# Altium schematic sheet 探测器最终图-论文用.SchDoc: 智能消防联动系统
size A3; Time: 2017.05.04; ProjectName: 探测器
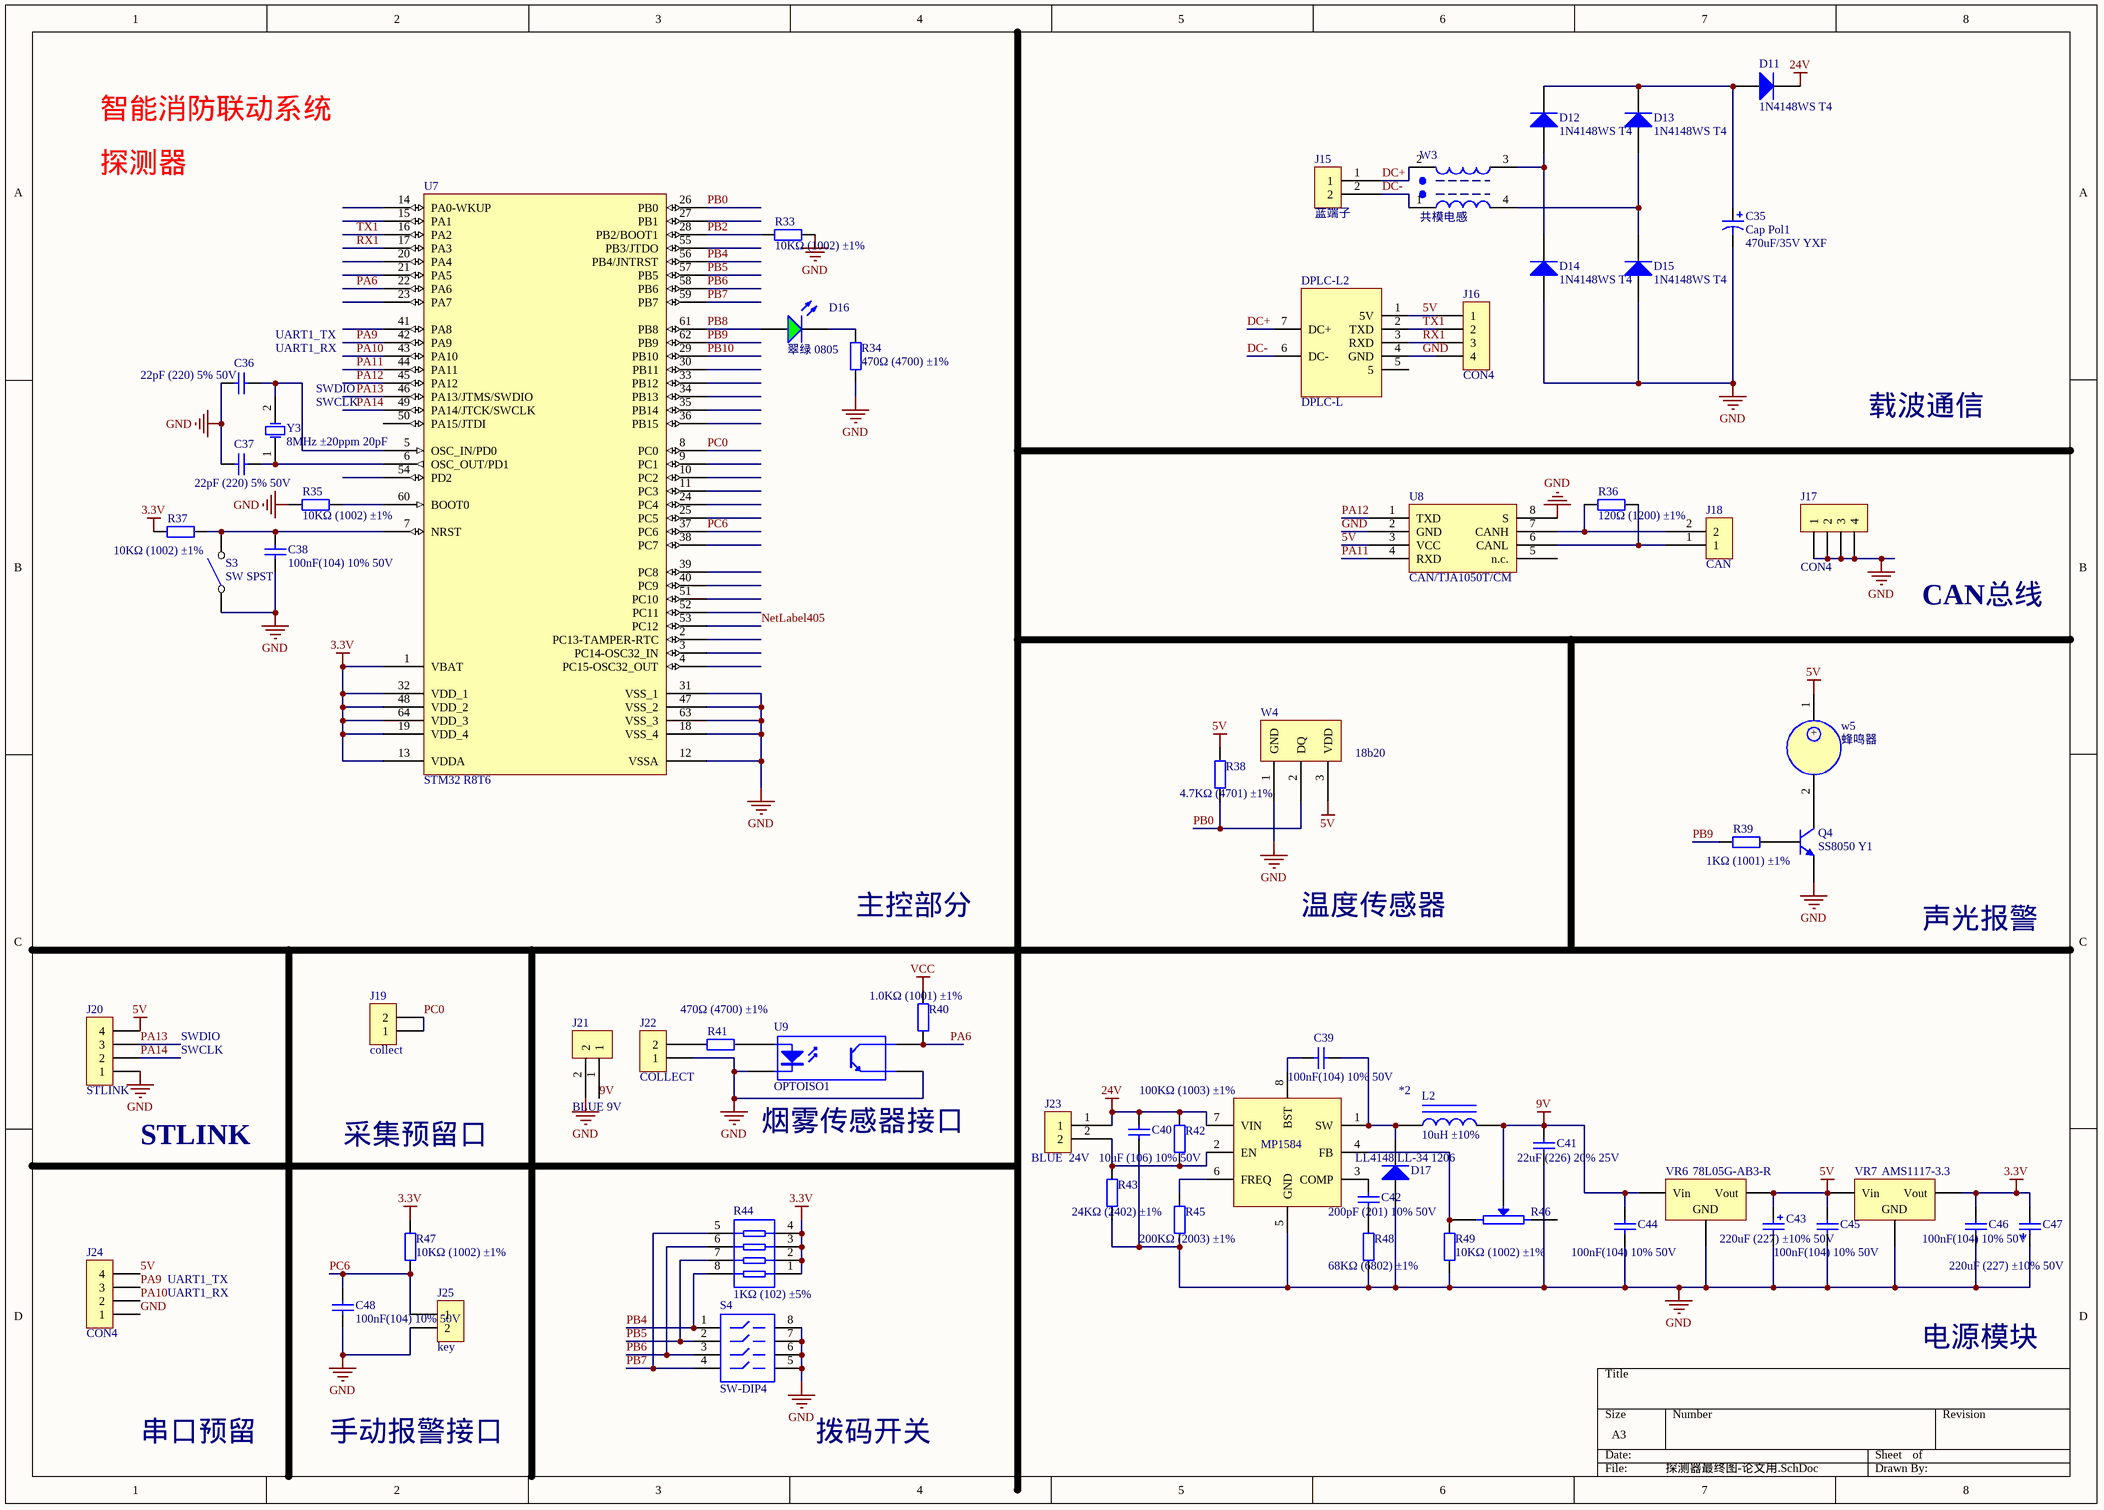
[diagram p0: 探测器最终图-论文用.SchDoc]

## Parts
*2  MP1584
C35  Cap Pol1  value 470uF/35V YXF  [RB.2/.4]
C36  22pF (220) 5% 50V  [LC-0805_C]
C37  22pF (220) 5% 50V  [LC-0805_C]
C38  100nF(104) 10% 50V  [LC-0805_C]
C39  100nF(104) 10% 50V  [LC-0805_C]
C40  10uF (106) 10% 50V  [LC-1206_C]
C41  22uF (226) 20% 25V  [LC-0805_C]
C42  200pF (201) 10% 50V  [LC-0805_C]
C43  220uF (227) ±10% 50V  [LC-CASE-B_3528]
C44  100nF(104) 10% 50V  [LC-0805_C]
C45  100nF(104) 10% 50V  [LC-0805_C]
C46  100nF(104) 10% 50V  [LC-0805_C]
C47  220uF (227) ±10% 50V  [LC-CASE-B_3528]
C48  100nF(104) 10% 50V  [LC-0805_C]
D11  1N4148WS T4  [LC-SOD-323]
D12  1N4148WS T4  [LC-SOD-323]
D13  1N4148WS T4  [LC-SOD-323]
D14  1N4148WS T4  [LC-SOD-323]
D15  1N4148WS T4  [LC-SOD-323]
D16  翠绿 0805  [LC-0805_LED_S1]
D17  LL4148 LL-34 1206  [LC-LL-34]
DPLC-L2  DPLC-L  [DPLC-L]
J15  蓝端子  [蓝端子]
J16  CON4  [SIP4]
J17  CON4  [SIP4]
J18  CAN  [蓝端子]
J19  collect  [SIP2]
J20  STLINK  [SIP4]
J21  BLUE 9V  [蓝端子]
J22  COLLECT  [SIP2]
J23  BLUE  24V  [蓝端子]
J24  CON4  [SIP4]
J25  key  [SIP2]
L2  10uH ±10%  [LC-0805_L]
Q4  SS8050 Y1  [LC-SOT-23(SOT-23-3)]
R33  10KΩ (1002) ±1%  [LC-0805_R]
R34  470Ω (4700) ±1%  [LC-0805_R]
R35  10KΩ (1002) ±1%  [LC-0805_R]
R36  120Ω (1200) ±1%  [LC-0805_R]
R37  10KΩ (1002) ±1%  [LC-0805_R]
R38  4.7KΩ (4701) ±1%  [LC-0805_R]
R39  1KΩ (1001) ±1%  [LC-0805_R]
R40  1.0KΩ (1001) ±1%  [LC-0805_R]
R41  470Ω (4700) ±1%  [LC-0805_R]
R42  100KΩ (1003) ±1%  [LC-0805_R]
R43  24KΩ (2402) ±1%  [LC-0805_R]
R44  1KΩ (102) ±5%  [LC-0603_Rx4]
R45  200KΩ (2003) ±1%  [LC-0805_R]
R46  2  (value not drawn)
R47  10KΩ (1002) ±1%  [LC-0805_R]
R48  68KΩ (6802) ±1%  [LC-0805_R]
R49  10KΩ (1002) ±1%  [LC-0805_R]
S3  SW SPST  [单片机小按键]
S4  SW-DIP4  [4位拨码开关]
U7  STM32 R8T6  [LC-LQFP-64_10x10x05P]
U8  CAN/TJA1050T/CM  [LC-SOIC-8_150mil]
U9  OPTOISO1  [LC-SOP-4_P2.54]
VR6  78L05G-AB3-R  [LC-SOT-89(SOT-89-3)]
VR7  AMS1117-3.3  [LC-SOT-223]
W3  共模电感  [共模电感]
W4  18b20  [DS18B20]
w5  蜂鸣器  [蜂鸣器]
Y3  8MHz ±20ppm 20pF  [LC-SMD-5032_2P]

## Nets
3.3V: C46.1 C47.2 R37.1 R44.1 R44.2 R44.3 R44.4 R47.2 U7.1(VBAT) U7.13(VDDA) U7.19(VDD_4) U7.32(VDD_1) U7.48(VDD_2) U7.64(VDD_3) VR7.2(Vout)
5V: C43.1 C45.2 DPLC-L2.1(5V) J16.1 J20.4 J24.4 R38.2 U8.3(VCC) VR6.3(Vout) VR7.3(Vin) W4.3(VDD) w5.1(+)
9V: C41.2 C44.2 J21.1 L2.2 R46.3(W) VR6.1(Vin)
24V: *2.7(VIN) C40.2 D11.2(K) J23.1 R42.2
GND: *2.5(GND) C35.2 C36.1 C37.1 C38.1 C40.1 C41.1 C43.2 C44.1 C45.1 C46.2 C47.1 C48.1 D14.1(A) D15.1(A) D17.1(A) DPLC-L2.4(GND) J16.4 J17.1 J17.2 J17.3 J17.4 J20.1 J21.2 J22.1 J24.1 J25.2 Q4.2(E) R33.1 R34.1 R35.1 R43.1 R45.1 R48.1 R49.1 S3.1(COMMON) S4.5 S4.6 S4.7 S4.8 U7.12(VSSA) U7.18(VSS_4) U7.31(VSS_1) U7.47(VSS_2) U7.63(VSS_3) U8.2(GND) U8.8(S) U9.2(K) U9.3(E) VR6.2(GND) VR7.1(GND) W4.1(GND)
VCC: R40.2
DC+: DPLC-L2.7(DC+) J15.1 W3.2
DC-: DPLC-L2.6(DC-) J15.2 W3.1
NetLabel405: U7.53(PC12)
PA6: R40.1 U7.22(PA6) U9.4(C)
PA9: J24.3 U7.42(PA9)
PA10: J24.2 U7.43(PA10)
PA11: U7.44(PA11) U8.4(RXD)
PA12: U7.45(PA12) U8.1(TXD)
PA13: J20.3 U7.46(PA13/JTMS/SWDIO)
PA14: J20.2 U7.49(PA14/JTCK/SWCLK)
PB0: R38.1 U7.26(PB0) W4.2(DQ)
PB2: R33.2 U7.28(PB2/BOOT1)
PB4: R44.8 S4.1 U7.56(PB4/JNTRST)
PB5: R44.7 S4.2 U7.57(PB5)
PB6: R44.6 S4.3 U7.58(PB6)
PB7: R44.5 S4.4 U7.59(PB7)
PB8: D16.A U7.61(PB8)
PB9: R39.1 U7.62(PB9)
PB10: U7.29(PB10)
PC0: J19.1 J19.2 U7.8(PC0)
PC6: C48.2 J25.1 R47.1 U7.37(PC6)
RX1: DPLC-L2.3(RXD) J16.3 U7.17(PA3)
TX1: DPLC-L2.2(TXD) J16.2 U7.16(PA2)
Net*2_1: *2.1(SW) C39.2 D17.2(K) L2.1
Net*2_2: *2.2(EN) J23.2 R42.1 R43.2
Net*2_3: *2.3(COMP) C42.2
Net*2_4: *2.4(FB) R46.1 R49.2
Net*2_6: *2.6(FREQ) R45.2
Net*2_8: *2.8(BST) C39.1
NetC35_1: C35.1 D11.1(A) D12.2(K) D13.2(K)
NetC36_2: C36.2 U7.5(OSC_IN/PD0) Y3.2(OSC2)
NetC37_2: C37.2 U7.6(OSC_OUT/PD1) Y3.1(OSC1)
NetC38_2: C38.2 R37.2 S3.2(NO) U7.7(NRST)
NetC42_1: C42.1 R48.2
NetD12_1: D12.1(A) D14.2(K) W3.3
NetD13_1: D13.1(A) D15.2(K) W3.4
NetD16_K: D16.K R34.2
NetJ18_1: J18.1 R36.2 U8.6(CANL)
NetJ18_2: J18.2 R36.1 U8.7(CANH)
NetJ22_2: J22.2 R41.2
NetQ4_1: Q4.1(B) R39.2
NetQ4_3: Q4.3(C) w5.2
NetR35_2: R35.2 U7.60(BOOT0)
NetR41_1: R41.1 U9.1(A)

Not connected (* = marked no-connect by the designer): DPLC-L2 5; R46 2; U7 2(PC13-TAMPER-RTC) 3(PC14-OSC32_IN) 4(PC15-OSC32_OUT) 9(PC1) 10(PC2) 11(PC3) 14(PA0-WKUP) 15(PA1) 20(PA4) 21(PA5) 23(PA7) 24(PC4) 25(PC5) 27(PB1) 30(PB11) 33(PB12) 34(PB13) 35(PB14) 36(PB15) 38(PC7) 39(PC8) 40(PC9) 41(PA8) 50(PA15/JTDI) 51(PC10) 52(PC11) 54(PD2) 55(PB3/JTDO); U8 5(n.c.)

## Notes on the sheet
- 智能消防联动系统
- 探测器
- (near C36) UART1_TX
- (near C36) UART1_RX
- SWDIO
- (near Y3) SWCLK
- 载波通信
- CAN总线
- 主控部分
- 温度传感器
- 声光报警
- SWCLK
- STLINK
- 采集预留口
- (near U9) 烟雾传感器接口
- UART1_TX
- UART1_RX
- 电源模块
- 串口预留
- 手动报警接口
- 拨码开关

## Library data of the parts
C35 = Cap Pol1: Polarized Capacitor (Radial); Published: 8-Jun-2000; LatestRevisionDate: 17-Jul-2002; LatestRevisionNote: Re-released for DXP Platform.; PackageReference: RB7.6-15; Publisher: Altium Limited; PackageDescription: Polarized Capacitor (Radial); 2 Leads
C36 C37 = 0805 22pF (220) 5% 50V: 贴片电容; ComponentLink1Description: 供应商链接; ComponentLink1URL: http://www.szlcsc.com/product/details_2156.html; Package: 0805; Supplier: LC; SuppliersPartNumber: C1804
C38 C39 C44-C46 C48 = 0805 100nF(104) 10% 50V: 贴片电容; ComponentLink1Description: 供应商链接; ComponentLink1URL: http://www.szlcsc.com/product/details_50686.html; Package: 0805; Supplier: LC; SuppliersPartNumber: C49678
C40 = 1206 10uF (106) 10% 50V: 贴片电容; ComponentLink1Description: 供应商链接; ComponentLink1URL: http://www.szlcsc.com/product/details_14236.html; Package: 1206; Supplier: LC; SuppliersPartNumber: C13585
C41 = 0805 22uF (226) 20% 25V: 贴片电容; ComponentLink1Description: 供应商链接; ComponentLink1URL: http://www.szlcsc.com/product/details_46786.html; Package: 0805; Supplier: LC; SuppliersPartNumber: C45783
C42 = 0805 200pF (201) 10% 50V: 贴片电容; ComponentLink1Description: 供应商链接; ComponentLink1URL: http://www.szlcsc.com/product/details_2076.html; Package: 0805; Supplier: LC; SuppliersPartNumber: C1724
C43 C47 = 3528 100uF (107) 10% 6.3V: 钽电容; ComponentLink1Description: 供应商链接; ComponentLink1URL: http://www.szlcsc.com/product/details_16815.html; Package: 3528; Supplier: LC; SuppliersPartNumber: C16133
D11-D15 = SOD-323 1N4148WS T4: 二极管; ComponentLink1Description: 供应商链接; ComponentLink1URL: http://www.szlcsc.com/product/details_2485.html; Package: SOD-323; Supplier: LC; SuppliersPartNumber: C2128
D16 = 0805 翠绿: 发光二极管; ComponentLink1Description: 供应商链接; ComponentLink1URL: http://www.szlcsc.com/product/details_2670.html; Package: 0805; Supplier: LC; SuppliersPartNumber: C2297
D17 = LL-34 LL4148 LL-34 1206: 开关二极管; ComponentLink1Description: 供应商链接; ComponentLink1URL: http://www.szlcsc.com/product/details_10338.html; Package: LL-34; Supplier: LC; SuppliersPartNumber: C9808
J18 J21 J23 = 蓝端子
J19 J22 J25 = CON2
J20 = CON4
L2 = 0805 10uH 10%: 贴片电感; ComponentLink1Description: 供应商链接; ComponentLink1URL: http://www.szlcsc.com/product/details_1398.html; Package: 0805; Supplier: LC; SuppliersPartNumber: C1046
Q4 = SOT-23 SS8050 Y1: 三极管; ComponentLink1Description: 供应商链接; ComponentLink1URL: http://www.szlcsc.com/product/details_2507.html; Package: SOT-23; Supplier: LC; SuppliersPartNumber: C2150
R33 R35 R37 R47 R49 = 0805 10KΩ (1002) 1%: 贴片电阻; ComponentLink1Description: 供应商链接; ComponentLink1URL: http://www.szlcsc.com/product/details_18102.html; Package: 0805; Supplier: LC; SuppliersPartNumber: C17414
R34 = 0805 470Ω (4700) 1%: 贴片电阻; ComponentLink1Description: 供应商链接; ComponentLink1URL: http://www.szlcsc.com/product/details_18398.html; Package: 0805; Supplier: LC; SuppliersPartNumber: C17710
R36 = 0805 120Ω (1200) 1%: 贴片电阻; ComponentLink1Description: 供应商链接; ComponentLink1URL: http://www.szlcsc.com/product/details_18125.html; Package: 0805; Supplier: LC; SuppliersPartNumber: C17437
R38 R40 R41 = 0805 4.7KΩ (4701) 1%: 贴片电阻; ComponentLink1Description: 供应商链接; ComponentLink1URL: http://www.szlcsc.com/product/details_18361.html; Package: 0805; Supplier: LC; SuppliersPartNumber: C17673
R39 = 0805 1KΩ (1001) 1%: 贴片电阻; ComponentLink1Description: 供应商链接; ComponentLink1URL: http://www.szlcsc.com/product/details_18201.html; Package: 0805; Supplier: LC; SuppliersPartNumber: C17513
R42 = 0805 100KΩ (1003) 1%: 贴片电阻; ComponentLink1Description: 供应商链接; ComponentLink1URL: http://www.szlcsc.com/product/details_18095.html; Package: 0805; Supplier: LC; SuppliersPartNumber: C17407
R43 = 0805 24KΩ (2402) 1%: 贴片电阻; ComponentLink1Description: 供应商链接; ComponentLink1URL: http://www.szlcsc.com/product/details_18263.html; Package: 0805; Supplier: LC; SuppliersPartNumber: C17575
R44 = 0603*4  1KΩ (102) 5%: 贴片排阻; ComponentLink1Description: 供应商链接; ComponentLink1URL: http://www.szlcsc.com/product/details_20907.html; Package: 0603*4; Supplier: LC; SuppliersPartNumber: C20197
R45 = 0805 200KΩ (2003) 1%: 贴片电阻; ComponentLink1Description: 供应商链接; ComponentLink1URL: http://www.szlcsc.com/product/details_18227.html; Package: 0805; Supplier: LC; SuppliersPartNumber: C17539
R46 = POT2: 滑变2
R48 = 0805 68KΩ (6802) 1%: 贴片电阻; ComponentLink1Description: 供应商链接; ComponentLink1URL: http://www.szlcsc.com/product/details_18489.html; Package: 0805; Supplier: LC; SuppliersPartNumber: C17801
S3 = SW SPST: 单刀单掷开关
S4 = SW-DIP4: 4位拨码开关
U8 = CAN/TJA1050T/CM: CAN; ComponentLink1Description: 供应商链接; ComponentLink1URL: http://www.szlcsc.com/product/details_7424.html; Package: SOIC-8_150mil; Supplier: LC; SuppliersPartNumber: C6952
U9 = OPTOISO1: 光电对管
VR6 = SOT-89 78L05G-AB3-R: 低压差线性稳压(LDO); ComponentLink1Description: 供应商链接; ComponentLink1URL: http://www.szlcsc.com/product/details_72235.html; Package: SOT-89; Supplier: LC; SuppliersPartNumber: C71136
VR7 = SOT-223 AMS1117-3.3: 低压差线性稳压(LDO); ComponentLink1Description: 供应商链接; ComponentLink1URL: http://www.szlcsc.com/product/details_6652.html; Package: SOT-223; Supplier: LC; SuppliersPartNumber: C6186
Y3 = SMD-5032_2P 8MHz 20ppm 20pF: 贴片晶振; ComponentLink1Description: 供应商链接; ComponentLink1URL: http://www.szlcsc.com/product/details_19261.html; Package: SMD-5032_2P; Supplier: LC; SuppliersPartNumber: C18560